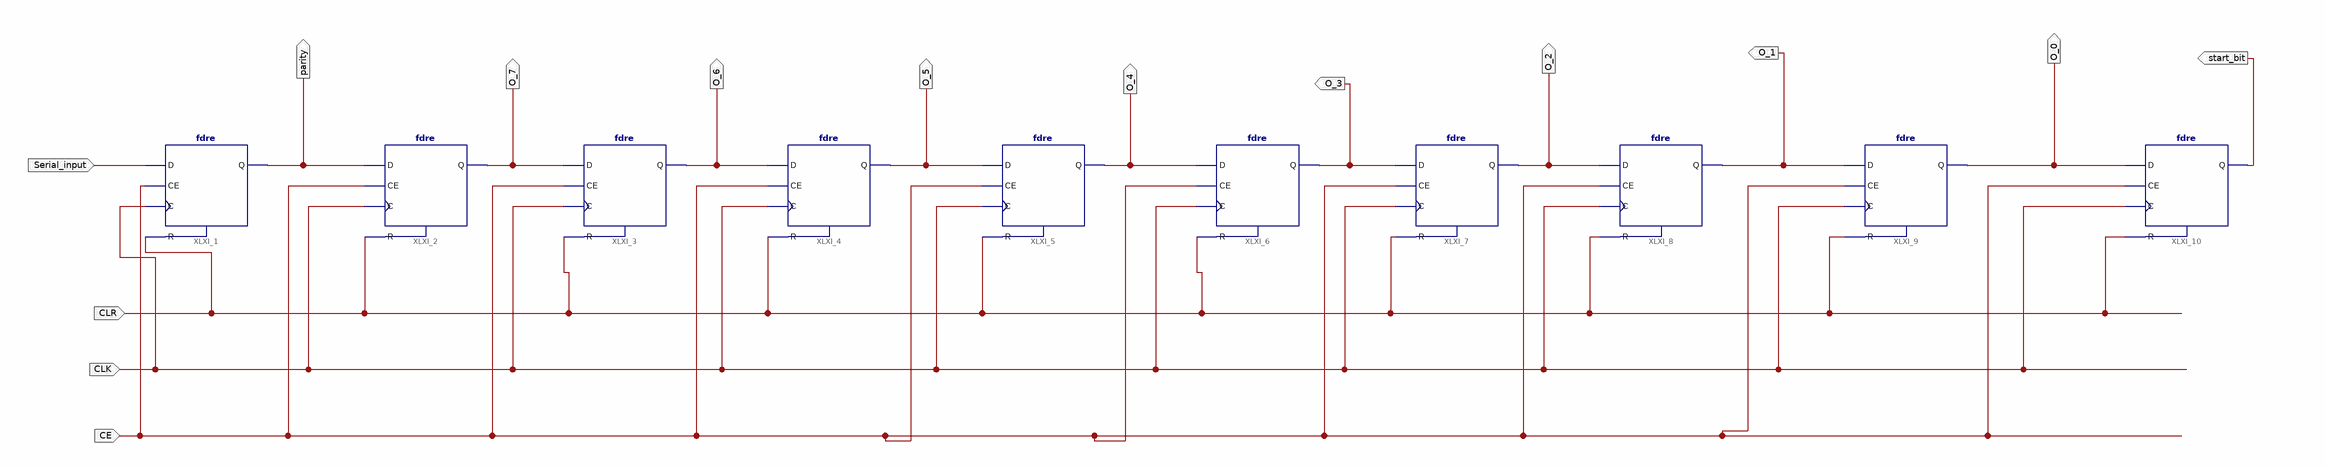
[diagram p0: schematic sheet 1]
// Xilinx ISE schematic SIPO_reg.sch (spartan3e) as structural Verilog: 10 symbols, 14 ports
module SIPO_reg (
  input  CE,
  input  CLK,
  input  CLR,
  input  Serial_input,
  output start_bit,
  output O_0,
  output O_1,
  output O_2,
  output O_3,
  output O_4,
  output O_5,
  output O_6,
  output O_7,
  output parity
);

  fdre XLXI_1 (.C(CLK), .CE(CE), .D(Serial_input), .R(CLR), .Q(parity));
  fdre XLXI_2 (.C(CLK), .CE(CE), .D(parity), .R(CLR), .Q(O_7));
  fdre XLXI_3 (.C(CLK), .CE(CE), .D(O_7), .R(CLR), .Q(O_6));
  fdre XLXI_4 (.C(CLK), .CE(CE), .D(O_6), .R(CLR), .Q(O_5));
  fdre XLXI_5 (.C(CLK), .CE(CE), .D(O_5), .R(CLR), .Q(O_4));
  fdre XLXI_6 (.C(CLK), .CE(CE), .D(O_4), .R(CLR), .Q(O_3));
  fdre XLXI_7 (.C(CLK), .CE(CE), .D(O_3), .R(CLR), .Q(O_2));
  fdre XLXI_8 (.C(CLK), .CE(CE), .D(O_2), .R(CLR), .Q(O_1));
  fdre XLXI_9 (.C(CLK), .CE(CE), .D(O_1), .R(CLR), .Q(O_0));
  fdre XLXI_10 (.C(CLK), .CE(CE), .D(O_0), .R(CLR), .Q(start_bit));
endmodule
